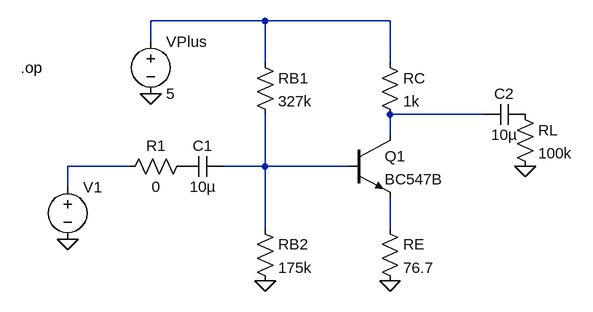
[diagram p0: schematic 2_2_a.asc]
2_2_a.asc, the LTspice schematic file:
Version 4.1
SHEET 1 880 680
WIRE 240 16 64 16
WIRE 432 16 240 16
WIRE 64 48 64 16
WIRE 240 80 240 16
WIRE 432 80 432 16
WIRE 576 160 432 160
WIRE 432 192 432 160
WIRE 32 240 -64 240
WIRE 240 240 240 160
WIRE 240 240 176 240
WIRE 368 240 240 240
WIRE -64 272 -64 240
WIRE 240 336 240 240
WIRE 432 336 432 288
FLAG 64 128 0
FLAG -64 352 0
FLAG 240 416 0
FLAG 432 416 0
FLAG 640 240 0
SYMBOL voltage 64 32 R0
SYMATTR InstName VPlus
SYMATTR Value 5
SYMBOL voltage -64 256 R0
SYMATTR InstName V1
SYMATTR Value ""
SYMBOL npn 368 192 R0
SYMATTR InstName Q1
SYMATTR Value BC547B
SYMBOL res 224 64 R0
SYMATTR InstName RB1
SYMATTR Value 327k
SYMBOL res 224 320 R0
SYMATTR InstName RB2
SYMATTR Value 175k
SYMBOL res 416 64 R0
SYMATTR InstName RC
SYMATTR Value 1k
SYMBOL res 624 144 R0
SYMATTR InstName RL
SYMATTR Value 100k
SYMBOL res 416 320 R0
SYMATTR InstName RE
SYMATTR Value 76.7
SYMBOL res 128 224 R90
WINDOW 0 0 56 VBottom 2
WINDOW 3 32 56 VTop 2
SYMATTR InstName R1
SYMATTR Value 0
SYMBOL cap 176 224 R90
WINDOW 0 0 32 VBottom 2
WINDOW 3 32 32 VTop 2
SYMATTR InstName C1
SYMATTR Value 10µ
SYMBOL cap 640 144 R90
WINDOW 0 0 32 VBottom 2
WINDOW 3 32 32 VTop 2
SYMATTR InstName C2
SYMATTR Value 10µ
TEXT -136 88 Left 2 !.op

The netlist it stands for:
* 2_2_a.asc
VPlus N001 0 5
V1 N003 0
Q1 N002 N004 N005 0 BC547B
RB1 N001 N004 327k
RB2 N004 0 175k
RC N001 N002 1k
RL P001 0 100k
RE N005 0 76.7
R1 P002 N003 0
C1 N004 P002 10µ
C2 P001 N002 10µ
.model NPN NPN
.model PNP PNP
.lib standard.bjt
.op
.backanno
.end